# Altium schematic sheet MR26_GSS_3.SchDoc
size 388 x 296 mm; Origin: Eagle; OriginPath: C:\Users\David Nguyen\Downloads\eagle\eagle\MR26_GSS.sch; OriginSheet: 4; OriginDescription: 05 FPGA power & decoupling
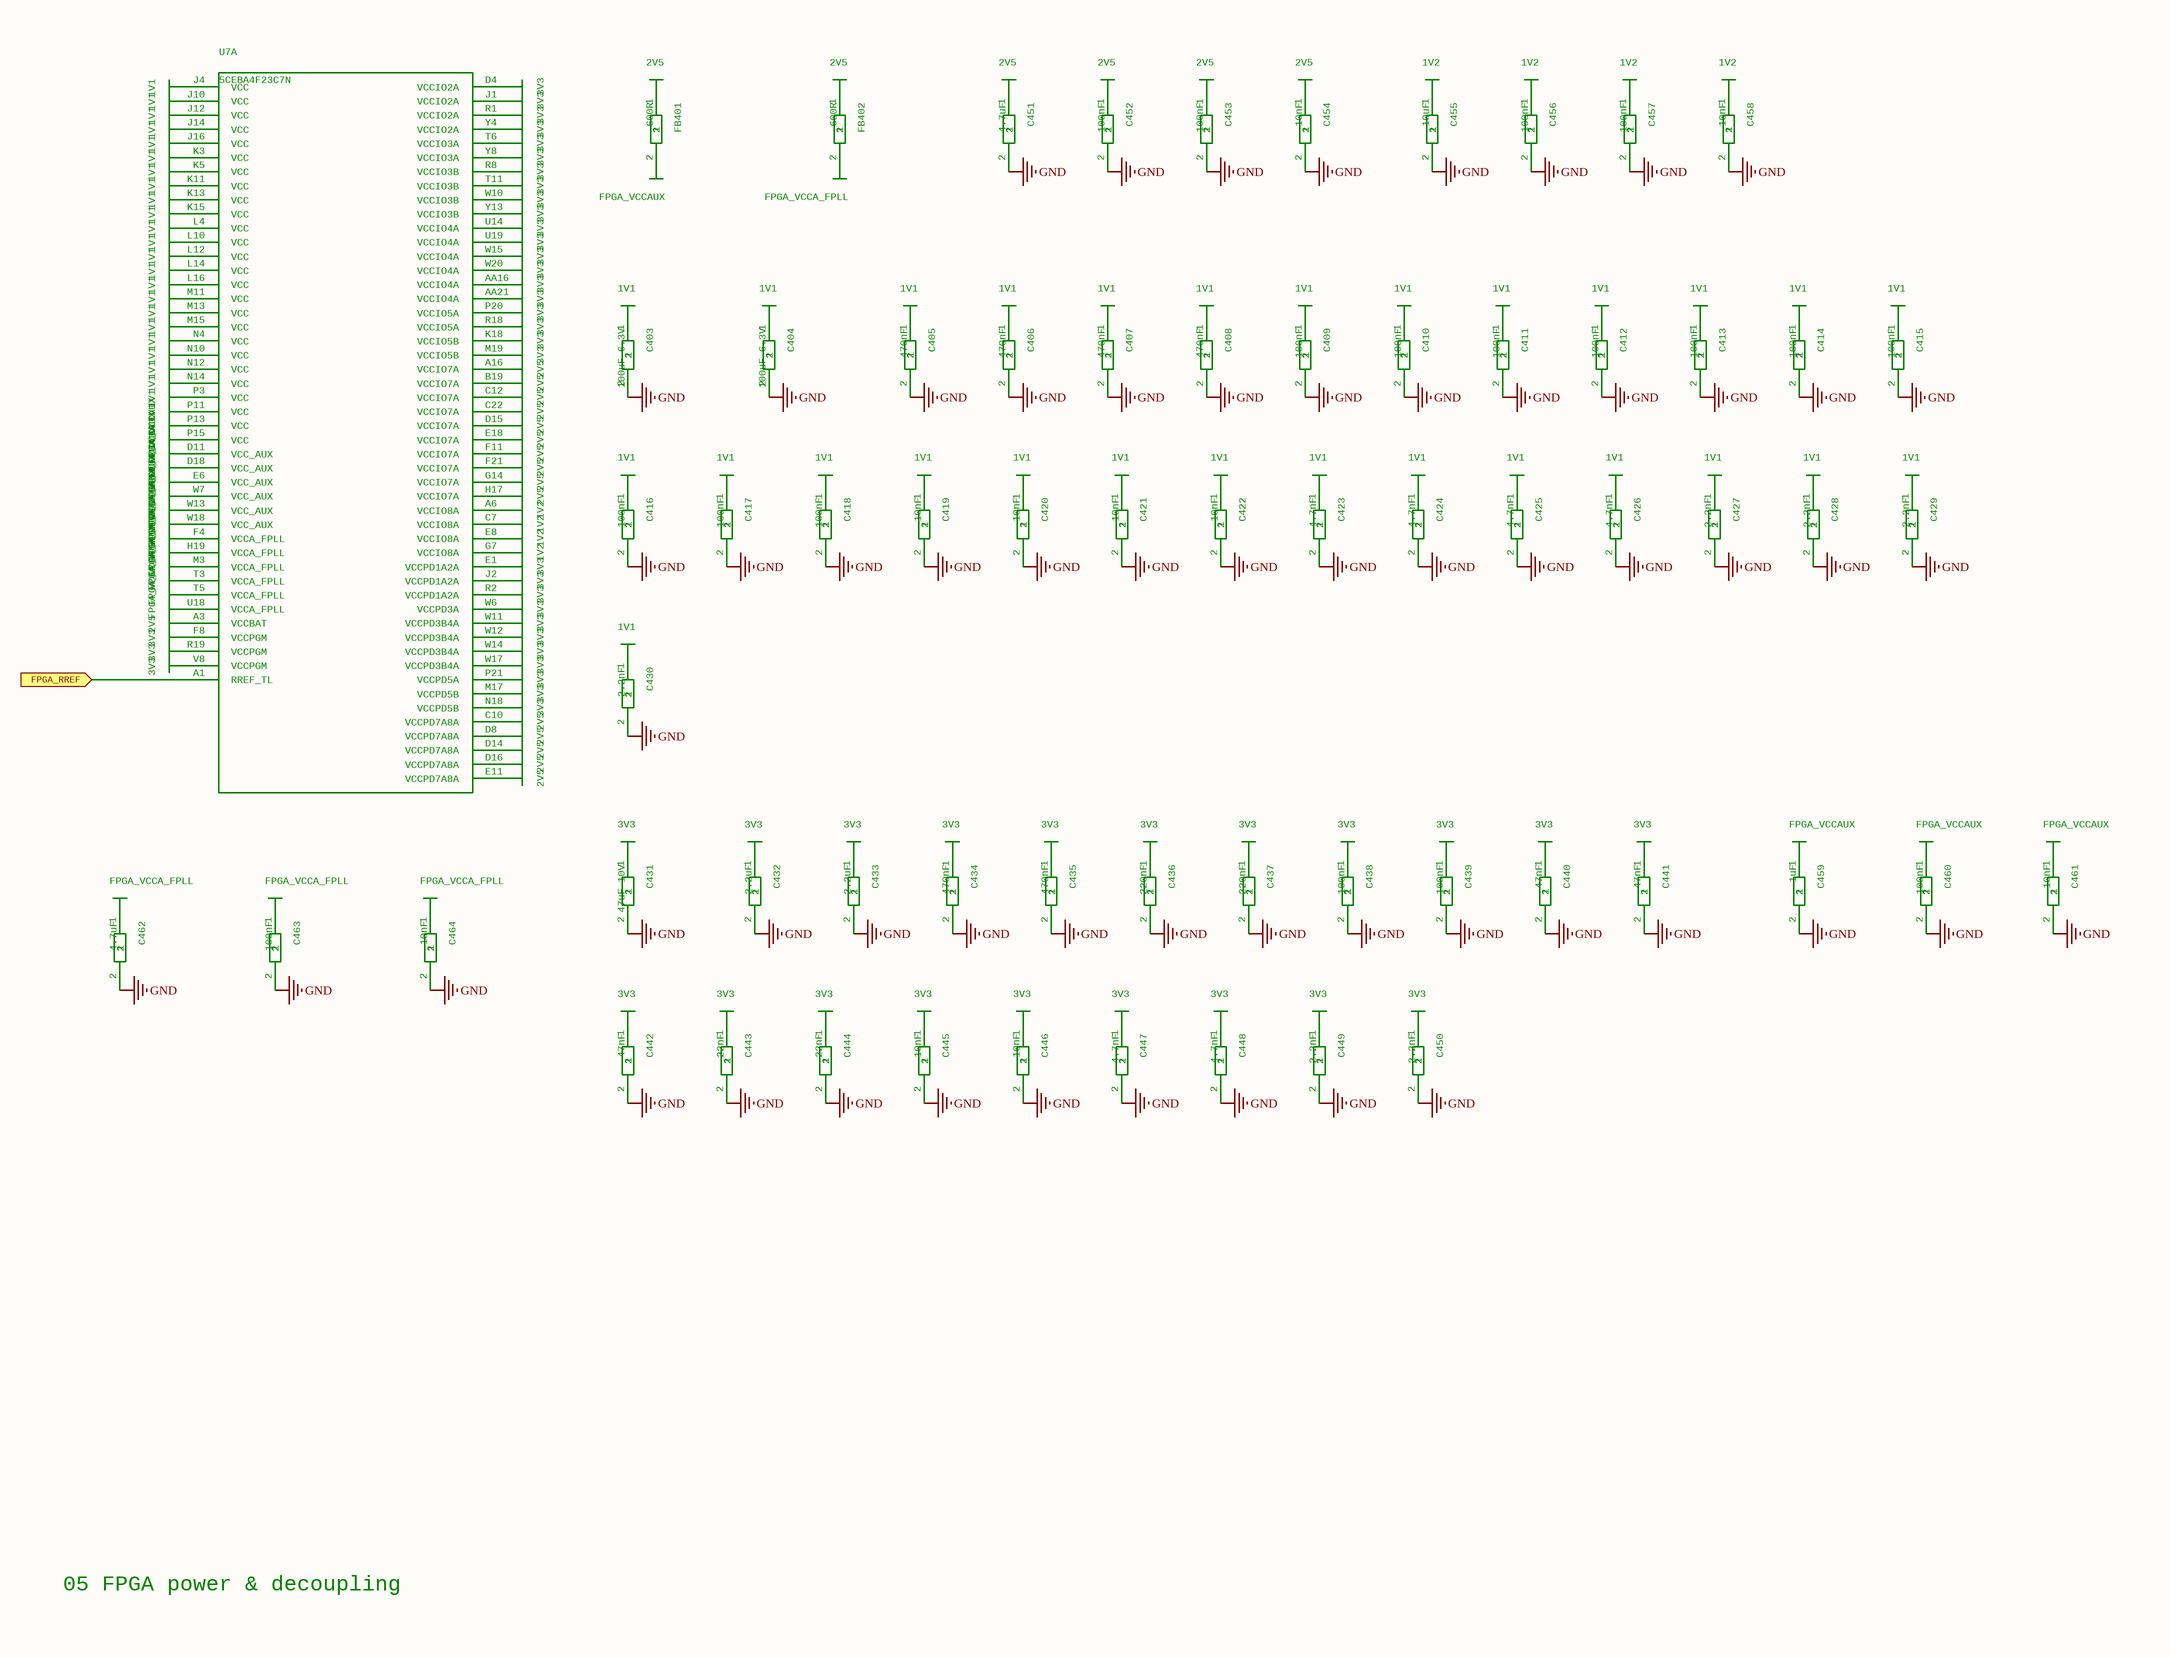
[diagram p0: MR26_GSS_3.SchDoc]

## Parts
C403  100uF 6.3V  [C_1210]
C404  100uF 6.3V  [C_1210]
C405  470nF  [C_0402]
C406  470nF  [C_0402]
C407  470nF  [C_0402]
C408  470nF  [C_0402]
C409  100nF  [C_0402]
C410  100nF  [C_0402]
C411  100nF  [C_0402]
C412  100nF  [C_0402]
C413  100nF  [C_0402]
C414  100nF  [C_0402]
C415  100nF  [C_0402]
C416  100nF  [C_0402]
C417  100nF  [C_0402]
C418  100nF  [C_0402]
C419  10nF  [C_0402]
C420  10nF  [C_0402]
C421  10nF  [C_0402]
C422  10nF  [C_0402]
C423  4.7nF  [C_0402]
C424  4.7nF  [C_0402]
C425  4.7nF  [C_0402]
C426  4.7nF  [C_0402]
C427  2.2nF  [C_0402]
C428  2.2nF  [C_0402]
C429  2.2nF  [C_0402]
C430  2.2nF  [C_0402]
C431  47uF 10V  [C_1210]
C432  2.2uF  [C_0603]
C433  2.2uF  [C_0603]
C434  470nF  [C_0402]
C435  470nF  [C_0402]
C436  220nF  [C_0402]
C437  220nF  [C_0402]
C438  100nF  [C_0402]
C439  100nF  [C_0402]
C440  47nF  [C_0402]
C441  47nF  [C_0402]
C442  47nF  [C_0402]
C443  22nF  [C_0402]
C444  22nF  [C_0402]
C445  10nF  [C_0402]
C446  10nF  [C_0402]
C447  4.7nF  [C_0402]
C448  4.7nF  [C_0402]
C449  2.2nF  [C_0402]
C450  2.2nF  [C_0402]
C451  4.7uF  [C_0603]
C452  100nF  [C_0402]
C453  100nF  [C_0402]
C454  10nF  [C_0402]
C455  10uF  [C_0603]
C456  100nF  [C_0402]
C457  100nF  [C_0402]
C458  10nF  [C_0402]
C459  1uF  [C_0402]
C460  100nF  [C_0402]
C461  10nF  [C_0402]
C462  4.7uF  [C_0603]
C463  100nF  [C_0402]
C464  10nF  [C_0402]
FB401  600R  [L_0603]
FB402  600R  [L_0603]
PWR0189  1V1
PWR0190  1V1
PWR0191  1V1
PWR0192  1V1
PWR0193  1V1
PWR0194  1V1
PWR0195  1V1
PWR0196  1V1
PWR0197  1V1
PWR0198  1V1
PWR0199  1V1
PWR0200  1V1
PWR0201  1V1
PWR0202  1V1
PWR0203  1V1
PWR0204  1V1
PWR0205  1V1
PWR0206  1V1
PWR0207  1V1
PWR0208  1V1
PWR0209  1V1
PWR0210  1V1
PWR0211  1V1
PWR0212  1V1
PWR0213  1V1
PWR0214  1V1
PWR0215  FPGA_VCCAUX
PWR0216  FPGA_VCCAUX
PWR0217  FPGA_VCCAUX
PWR0218  FPGA_VCCAUX
PWR0219  FPGA_VCCAUX
PWR0220  FPGA_VCCAUX
PWR0221  FPGA_VCCA_FPLL
PWR0222  FPGA_VCCA_FPLL
PWR0223  FPGA_VCCA_FPLL
PWR0224  FPGA_VCCA_FPLL
PWR0225  FPGA_VCCA_FPLL
PWR0226  FPGA_VCCA_FPLL
PWR0227  2V5
PWR0228  3V3
PWR0229  3V3
PWR0230  3V3
PWR0231  3V3
PWR0232  3V3
PWR0233  3V3
PWR0234  3V3
PWR0235  3V3
PWR0236  3V3
PWR0237  3V3
PWR0238  3V3
PWR0239  3V3
PWR0240  3V3
PWR0241  3V3
PWR0242  3V3
PWR0243  3V3
PWR0244  3V3
PWR0245  3V3
PWR0246  3V3
PWR0247  3V3
PWR0248  3V3
PWR0249  3V3
PWR0250  3V3
PWR0251  2V5
PWR0252  2V5
PWR0253  2V5
PWR0254  2V5
PWR0255  2V5
PWR0256  2V5
PWR0257  2V5
PWR0258  2V5
PWR0259  2V5
PWR0260  2V5
PWR0261  1V2
PWR0262  1V2
PWR0263  1V2
PWR0264  1V2
PWR0265  3V3
PWR0266  3V3
PWR0267  3V3
PWR0268  3V3
PWR0269  3V3
PWR0270  3V3
PWR0271  3V3
PWR0272  3V3
PWR0273  3V3
PWR0274  3V3
PWR0275  3V3
PWR0276  2V5
PWR0277  2V5
PWR0278  2V5
PWR0279  2V5
PWR0280  2V5
PWR0281  2V5
PWR0282  FPGA_VCCAUX
PWR0283  2V5
PWR0284  FPGA_VCCA_FPLL
PWR0285  1V1
PWR0287  1V1
PWR0289  1V1
PWR0291  1V1
PWR0293  1V1
PWR0295  1V1
PWR0297  1V1
PWR0299  1V1
PWR0301  1V1
PWR0303  1V1
PWR0305  1V1
PWR0307  1V1
PWR0309  1V1
PWR0311  1V1
PWR0313  1V1
PWR0315  1V1
PWR0317  1V1
PWR0319  1V1
PWR0321  1V1
PWR0323  1V1
PWR0325  1V1
PWR0327  1V1
PWR0329  1V1
PWR0331  1V1
PWR0333  1V1
PWR0335  1V1
PWR0337  1V1
PWR0339  1V1
PWR0341  3V3
PWR0343  3V3
PWR0345  3V3
PWR0347  3V3
PWR0349  3V3
PWR0351  3V3
PWR0353  3V3
PWR0355  3V3
PWR0357  3V3
PWR0359  3V3
PWR0361  3V3
PWR0363  3V3
PWR0365  3V3
PWR0367  3V3
PWR0369  3V3
PWR0371  3V3
PWR0373  3V3
PWR0375  3V3
PWR0377  3V3
PWR0379  3V3
PWR0381  2V5
PWR0383  2V5
PWR0385  2V5
PWR0387  2V5
PWR0389  1V2
PWR0391  1V2
PWR0393  1V2
PWR0395  1V2
PWR0397  FPGA_VCCAUX
PWR0399  FPGA_VCCAUX
PWR0401  FPGA_VCCAUX
PWR0403  FPGA_VCCA_FPLL
PWR0405  FPGA_VCCA_FPLL
PWR0407  FPGA_VCCA_FPLL
U7  5CEBA4F23C7N  [FBGA-484_23x23_1.0mm]  (part A of 12)

## Ports
FPGA_RREF (in)

## Nets
GND: C403.2 C404.2 C405.2 C406.2 C407.2 C408.2 C409.2 C410.2 C411.2 C412.2 C413.2 C414.2 C415.2 C416.2 C417.2 C418.2 C419.2 C420.2 C421.2 C422.2 C423.2 C424.2 C425.2 C426.2 C427.2 C428.2 C429.2 C430.2 C431.2 C432.2 C433.2 C434.2 C435.2 C436.2 C437.2 C438.2 C439.2 C440.2 C441.2 C442.2 C443.2 C444.2 C445.2 C446.2 C447.2 C448.2 C449.2 C450.2 C451.2 C452.2 C453.2 C454.2 C455.2 C456.2 C457.2 C458.2 C459.2 C460.2 C461.2 C462.2 C463.2 C464.2
FPGA_RREF: U7.A1(RREF_TL) ; port FPGA_RREF
NetC403_1: C403.1 PWR0285.?1(1V1)
NetC404_1: C404.1 PWR0287.?1(1V1)
NetC405_1: C405.1 PWR0289.?1(1V1)
NetC406_1: C406.1 PWR0291.?1(1V1)
NetC407_1: C407.1 PWR0293.?1(1V1)
NetC408_1: C408.1 PWR0295.?1(1V1)
NetC409_1: C409.1 PWR0297.?1(1V1)
NetC410_1: C410.1 PWR0299.?1(1V1)
NetC411_1: C411.1 PWR0301.?1(1V1)
NetC412_1: C412.1 PWR0303.?1(1V1)
NetC413_1: C413.1 PWR0305.?1(1V1)
NetC414_1: C414.1 PWR0307.?1(1V1)
NetC415_1: C415.1 PWR0309.?1(1V1)
NetC416_1: C416.1 PWR0311.?1(1V1)
NetC417_1: C417.1 PWR0313.?1(1V1)
NetC418_1: C418.1 PWR0315.?1(1V1)
NetC419_1: C419.1 PWR0317.?1(1V1)
NetC420_1: C420.1 PWR0319.?1(1V1)
NetC421_1: C421.1 PWR0321.?1(1V1)
NetC422_1: C422.1 PWR0323.?1(1V1)
NetC423_1: C423.1 PWR0325.?1(1V1)
NetC424_1: C424.1 PWR0327.?1(1V1)
NetC425_1: C425.1 PWR0329.?1(1V1)
NetC426_1: C426.1 PWR0331.?1(1V1)
NetC427_1: C427.1 PWR0333.?1(1V1)
NetC428_1: C428.1 PWR0335.?1(1V1)
NetC429_1: C429.1 PWR0337.?1(1V1)
NetC430_1: C430.1 PWR0339.?1(1V1)
NetC431_1: C431.1 PWR0341.?1(3V3)
NetC432_1: C432.1 PWR0343.?1(3V3)
NetC433_1: C433.1 PWR0345.?1(3V3)
NetC434_1: C434.1 PWR0347.?1(3V3)
NetC435_1: C435.1 PWR0349.?1(3V3)
NetC436_1: C436.1 PWR0351.?1(3V3)
NetC437_1: C437.1 PWR0353.?1(3V3)
NetC438_1: C438.1 PWR0355.?1(3V3)
NetC439_1: C439.1 PWR0357.?1(3V3)
NetC440_1: C440.1 PWR0359.?1(3V3)
NetC441_1: C441.1 PWR0361.?1(3V3)
NetC442_1: C442.1 PWR0363.?1(3V3)
NetC443_1: C443.1 PWR0365.?1(3V3)
NetC444_1: C444.1 PWR0367.?1(3V3)
NetC445_1: C445.1 PWR0369.?1(3V3)
NetC446_1: C446.1 PWR0371.?1(3V3)
NetC447_1: C447.1 PWR0373.?1(3V3)
NetC448_1: C448.1 PWR0375.?1(3V3)
NetC449_1: C449.1 PWR0377.?1(3V3)
NetC450_1: C450.1 PWR0379.?1(3V3)
NetC451_1: C451.1 PWR0381.?1(2V5)
NetC452_1: C452.1 PWR0383.?1(2V5)
NetC453_1: C453.1 PWR0385.?1(2V5)
NetC454_1: C454.1 PWR0387.?1(2V5)
NetC455_1: C455.1 PWR0389.?1(1V2)
NetC456_1: C456.1 PWR0391.?1(1V2)
NetC457_1: C457.1 PWR0393.?1(1V2)
NetC458_1: C458.1 PWR0395.?1(1V2)
NetC459_1: C459.1 PWR0397.?1(FPGA_VCCAUX)
NetC460_1: C460.1 PWR0399.?1(FPGA_VCCAUX)
NetC461_1: C461.1 PWR0401.?1(FPGA_VCCAUX)
NetC462_1: C462.1 PWR0403.?1(FPGA_VCCA_FPLL)
NetC463_1: C463.1 PWR0405.?1(FPGA_VCCA_FPLL)
NetC464_1: C464.1 PWR0407.?1(FPGA_VCCA_FPLL)
NetFB401_1: FB401.1 PWR0281.?1(2V5)
NetFB401_2: FB401.2 PWR0282.?1(FPGA_VCCAUX)
NetFB402_1: FB402.1 PWR0283.?1(2V5)
NetFB402_2: FB402.2 PWR0284.?1(FPGA_VCCA_FPLL)
NetPWR0189_?1: PWR0189.?1(1V1) U7.J4(VCC)
NetPWR0190_?1: PWR0190.?1(1V1) U7.J10(VCC)
NetPWR0191_?1: PWR0191.?1(1V1) U7.J12(VCC)
NetPWR0192_?1: PWR0192.?1(1V1) U7.J14(VCC)
NetPWR0193_?1: PWR0193.?1(1V1) U7.J16(VCC)
NetPWR0194_?1: PWR0194.?1(1V1) U7.K3(VCC)
NetPWR0195_?1: PWR0195.?1(1V1) U7.K5(VCC)
NetPWR0196_?1: PWR0196.?1(1V1) U7.K11(VCC)
NetPWR0197_?1: PWR0197.?1(1V1) U7.K13(VCC)
NetPWR0198_?1: PWR0198.?1(1V1) U7.K15(VCC)
NetPWR0199_?1: PWR0199.?1(1V1) U7.L4(VCC)
NetPWR0200_?1: PWR0200.?1(1V1) U7.L10(VCC)
NetPWR0201_?1: PWR0201.?1(1V1) U7.L12(VCC)
NetPWR0202_?1: PWR0202.?1(1V1) U7.L14(VCC)
NetPWR0203_?1: PWR0203.?1(1V1) U7.L16(VCC)
NetPWR0204_?1: PWR0204.?1(1V1) U7.M11(VCC)
NetPWR0205_?1: PWR0205.?1(1V1) U7.M13(VCC)
NetPWR0206_?1: PWR0206.?1(1V1) U7.M15(VCC)
NetPWR0207_?1: PWR0207.?1(1V1) U7.N4(VCC)
NetPWR0208_?1: PWR0208.?1(1V1) U7.N10(VCC)
NetPWR0209_?1: PWR0209.?1(1V1) U7.N12(VCC)
NetPWR0210_?1: PWR0210.?1(1V1) U7.N14(VCC)
NetPWR0211_?1: PWR0211.?1(1V1) U7.P3(VCC)
NetPWR0212_?1: PWR0212.?1(1V1) U7.P11(VCC)
NetPWR0213_?1: PWR0213.?1(1V1) U7.P13(VCC)
NetPWR0214_?1: PWR0214.?1(1V1) U7.P15(VCC)
NetPWR0215_?1: PWR0215.?1(FPGA_VCCAUX) U7.D11(VCC_AUX)
NetPWR0216_?1: PWR0216.?1(FPGA_VCCAUX) U7.D18(VCC_AUX)
NetPWR0217_?1: PWR0217.?1(FPGA_VCCAUX) U7.E6(VCC_AUX)
NetPWR0218_?1: PWR0218.?1(FPGA_VCCAUX) U7.W7(VCC_AUX)
NetPWR0219_?1: PWR0219.?1(FPGA_VCCAUX) U7.W13(VCC_AUX)
NetPWR0220_?1: PWR0220.?1(FPGA_VCCAUX) U7.W18(VCC_AUX)
NetPWR0221_?1: PWR0221.?1(FPGA_VCCA_FPLL) U7.F4(VCCA_FPLL)
NetPWR0222_?1: PWR0222.?1(FPGA_VCCA_FPLL) U7.H19(VCCA_FPLL)
NetPWR0223_?1: PWR0223.?1(FPGA_VCCA_FPLL) U7.M3(VCCA_FPLL)
NetPWR0224_?1: PWR0224.?1(FPGA_VCCA_FPLL) U7.T3(VCCA_FPLL)
NetPWR0225_?1: PWR0225.?1(FPGA_VCCA_FPLL) U7.T5(VCCA_FPLL)
NetPWR0226_?1: PWR0226.?1(FPGA_VCCA_FPLL) U7.U18(VCCA_FPLL)
NetPWR0227_?1: PWR0227.?1(2V5) U7.A3(VCCBAT)
NetPWR0228_?1: PWR0228.?1(3V3) U7.F8(VCCPGM)
NetPWR0229_?1: PWR0229.?1(3V3) U7.R19(VCCPGM)
NetPWR0230_?1: PWR0230.?1(3V3) U7.V8(VCCPGM)
NetPWR0231_?1: PWR0231.?1(3V3) U7.D4(VCCIO2A)
NetPWR0232_?1: PWR0232.?1(3V3) U7.J1(VCCIO2A)
NetPWR0233_?1: PWR0233.?1(3V3) U7.R1(VCCIO2A)
NetPWR0234_?1: PWR0234.?1(3V3) U7.Y4(VCCIO2A)
NetPWR0235_?1: PWR0235.?1(3V3) U7.T6(VCCIO3A)
NetPWR0236_?1: PWR0236.?1(3V3) U7.Y8(VCCIO3A)
NetPWR0237_?1: PWR0237.?1(3V3) U7.R8(VCCIO3B)
NetPWR0238_?1: PWR0238.?1(3V3) U7.T11(VCCIO3B)
NetPWR0239_?1: PWR0239.?1(3V3) U7.W10(VCCIO3B)
NetPWR0240_?1: PWR0240.?1(3V3) U7.Y13(VCCIO3B)
NetPWR0241_?1: PWR0241.?1(3V3) U7.U14(VCCIO4A)
NetPWR0242_?1: PWR0242.?1(3V3) U7.U19(VCCIO4A)
NetPWR0243_?1: PWR0243.?1(3V3) U7.W15(VCCIO4A)
NetPWR0244_?1: PWR0244.?1(3V3) U7.W20(VCCIO4A)
NetPWR0245_?1: PWR0245.?1(3V3) U7.AA16(VCCIO4A)
NetPWR0246_?1: PWR0246.?1(3V3) U7.AA21(VCCIO4A)
NetPWR0247_?1: PWR0247.?1(3V3) U7.P20(VCCIO5A)
NetPWR0248_?1: PWR0248.?1(3V3) U7.R18(VCCIO5A)
NetPWR0249_?1: PWR0249.?1(3V3) U7.K18(VCCIO5B)
NetPWR0250_?1: PWR0250.?1(3V3) U7.M19(VCCIO5B)
NetPWR0251_?1: PWR0251.?1(2V5) U7.A16(VCCIO7A)
NetPWR0252_?1: PWR0252.?1(2V5) U7.B19(VCCIO7A)
NetPWR0253_?1: PWR0253.?1(2V5) U7.C12(VCCIO7A)
NetPWR0254_?1: PWR0254.?1(2V5) U7.C22(VCCIO7A)
NetPWR0255_?1: PWR0255.?1(2V5) U7.D15(VCCIO7A)
NetPWR0256_?1: PWR0256.?1(2V5) U7.E18(VCCIO7A)
NetPWR0257_?1: PWR0257.?1(2V5) U7.F11(VCCIO7A)
NetPWR0258_?1: PWR0258.?1(2V5) U7.F21(VCCIO7A)
NetPWR0259_?1: PWR0259.?1(2V5) U7.G14(VCCIO7A)
NetPWR0260_?1: PWR0260.?1(2V5) U7.H17(VCCIO7A)
NetPWR0261_?1: PWR0261.?1(1V2) U7.A6(VCCIO8A)
NetPWR0262_?1: PWR0262.?1(1V2) U7.C7(VCCIO8A)
NetPWR0263_?1: PWR0263.?1(1V2) U7.E8(VCCIO8A)
NetPWR0264_?1: PWR0264.?1(1V2) U7.G7(VCCIO8A)
NetPWR0265_?1: PWR0265.?1(3V3) U7.E1(VCCPD1A2A)
NetPWR0266_?1: PWR0266.?1(3V3) U7.J2(VCCPD1A2A)
NetPWR0267_?1: PWR0267.?1(3V3) U7.R2(VCCPD1A2A)
NetPWR0268_?1: PWR0268.?1(3V3) U7.W6(VCCPD3A)
NetPWR0269_?1: PWR0269.?1(3V3) U7.W11(VCCPD3B4A)
NetPWR0270_?1: PWR0270.?1(3V3) U7.W12(VCCPD3B4A)
NetPWR0271_?1: PWR0271.?1(3V3) U7.W14(VCCPD3B4A)
NetPWR0272_?1: PWR0272.?1(3V3) U7.W17(VCCPD3B4A)
NetPWR0273_?1: PWR0273.?1(3V3) U7.P21(VCCPD5A)
NetPWR0274_?1: PWR0274.?1(3V3) U7.M17(VCCPD5B)
NetPWR0275_?1: PWR0275.?1(3V3) U7.N18(VCCPD5B)
NetPWR0276_?1: PWR0276.?1(2V5) U7.C10(VCCPD7A8A)
NetPWR0277_?1: PWR0277.?1(2V5) U7.D8(VCCPD7A8A)
NetPWR0278_?1: PWR0278.?1(2V5) U7.D14(VCCPD7A8A)
NetPWR0279_?1: PWR0279.?1(2V5) U7.D16(VCCPD7A8A)
NetPWR0280_?1: PWR0280.?1(2V5) U7.E11(VCCPD7A8A)

## Notes on the sheet
- 05 FPGA power & decoupling

## Library data of the parts
C403 C404 = CAPC_1210: MPN: CAP 100uF 6.3V 1210; GateName_1: G$1; SymbolName_1: CAP; DeviceName: C_1210; LibraryName: MR26; DeviceSetName: CAP
C405-C408 C434 C435 = CAPC_0402: MPN: CAP 470nF 0402; GateName_1: G$1; SymbolName_1: CAP; DeviceName: C_0402; LibraryName: MR26; DeviceSetName: CAP
C409-C418 C438 C439 C452 C453 C456 C457 C460 C463 = CAPC_0402: MPN: CAP 100nF 0402; GateName_1: G$1; SymbolName_1: CAP; DeviceName: C_0402; LibraryName: MR26; DeviceSetName: CAP
C419-C422 C445 C446 C454 C458 C461 C464 = CAPC_0402: MPN: CAP 10nF 0402; GateName_1: G$1; SymbolName_1: CAP; DeviceName: C_0402; LibraryName: MR26; DeviceSetName: CAP
C423-C426 C447 C448 = CAPC_0402: MPN: CAP 4.7nF 0402; GateName_1: G$1; SymbolName_1: CAP; DeviceName: C_0402; LibraryName: MR26; DeviceSetName: CAP
C427-C430 C449 C450 = CAPC_0402: MPN: CAP 2.2nF 0402; GateName_1: G$1; SymbolName_1: CAP; DeviceName: C_0402; LibraryName: MR26; DeviceSetName: CAP
C431 = CAPC_1210: MPN: CAP 47uF 10V 1210; GateName_1: G$1; SymbolName_1: CAP; DeviceName: C_1210; LibraryName: MR26; DeviceSetName: CAP
C432 C433 = CAPC_0603: MPN: CAP 2.2uF 0603; GateName_1: G$1; SymbolName_1: CAP; DeviceName: C_0603; LibraryName: MR26; DeviceSetName: CAP
C436 C437 = CAPC_0402: MPN: CAP 220nF 0402; GateName_1: G$1; SymbolName_1: CAP; DeviceName: C_0402; LibraryName: MR26; DeviceSetName: CAP
C440-C442 = CAPC_0402: MPN: CAP 47nF 0402; GateName_1: G$1; SymbolName_1: CAP; DeviceName: C_0402; LibraryName: MR26; DeviceSetName: CAP
C443 C444 = CAPC_0402: MPN: CAP 22nF 0402; GateName_1: G$1; SymbolName_1: CAP; DeviceName: C_0402; LibraryName: MR26; DeviceSetName: CAP
C451 C462 = CAPC_0603: MPN: CAP 4.7uF 0603; GateName_1: G$1; SymbolName_1: CAP; DeviceName: C_0603; LibraryName: MR26; DeviceSetName: CAP
C455 = CAPC_0603: MPN: CAP 10uF 0603; GateName_1: G$1; SymbolName_1: CAP; DeviceName: C_0603; LibraryName: MR26; DeviceSetName: CAP
C459 = CAPC_0402: MPN: CAP 1uF 0402; GateName_1: G$1; SymbolName_1: CAP; DeviceName: C_0402; LibraryName: MR26; DeviceSetName: CAP
FB401 FB402 = FERRITEL_0603: MPN: Murata BLM18KG601SN1D; GateName_1: G$1; SymbolName_1: FERRITE; DeviceName: L_0603; LibraryName: MR26; DeviceSetName: FERRITE
PWR0189 PWR0190 PWR0191 PWR0192 PWR0193 PWR0194 PWR0195 PWR0196 PWR0197 PWR0198 PWR0199 PWR0200 PWR0201 PWR0202 PWR0203 PWR0204 PWR0205 PWR0206 PWR0207 PWR0208 PWR0209 PWR0210 PWR0211 PWR0212 PWR0213 PWR0214 PWR0285 PWR0287 PWR0289 PWR0291 PWR0293 PWR0295 PWR0297 PWR0299 PWR0301 PWR0303 PWR0305 PWR0307 PWR0309 PWR0311 PWR0313 PWR0315 PWR0317 PWR0319 PWR0321 PWR0323 PWR0325 PWR0327 PWR0329 PWR0331 PWR0333 PWR0335 PWR0337 PWR0339 = PWR_1V1: GateName_1: G$1; SymbolName_1: PWR_1V1; LibraryName: MR26; DeviceSetName: PWR_1V1
PWR0215 PWR0216 PWR0217 PWR0218 PWR0219 PWR0220 PWR0282 PWR0397 PWR0399 PWR0401 = PWR_FPGA_VCCAUX: GateName_1: G$1; SymbolName_1: PWR_FPGA_VCCAUX; LibraryName: MR26; DeviceSetName: PWR_FPGA_VCCAUX
PWR0221 PWR0222 PWR0223 PWR0224 PWR0225 PWR0226 PWR0284 PWR0403 PWR0405 PWR0407 = PWR_FPGA_VCCA_FPLL: GateName_1: G$1; SymbolName_1: PWR_FPGA_VCCA_FPLL; LibraryName: MR26; DeviceSetName: PWR_FPGA_VCCA_FPLL
PWR0227 PWR0251 PWR0252 PWR0253 PWR0254 PWR0255 PWR0256 PWR0257 PWR0258 PWR0259 PWR0260 PWR0276 PWR0277 PWR0278 PWR0279 PWR0280 PWR0281 PWR0283 PWR0381 PWR0383 PWR0385 PWR0387 = PWR_2V5: GateName_1: G$1; SymbolName_1: PWR_2V5; LibraryName: MR26; DeviceSetName: PWR_2V5
PWR0228 PWR0229 PWR0230 PWR0231 PWR0232 PWR0233 PWR0234 PWR0235 PWR0236 PWR0237 PWR0238 PWR0239 PWR0240 PWR0241 PWR0242 PWR0243 PWR0244 PWR0245 PWR0246 PWR0247 PWR0248 PWR0249 PWR0250 PWR0265 PWR0266 PWR0267 PWR0268 PWR0269 PWR0270 PWR0271 PWR0272 PWR0273 PWR0274 PWR0275 PWR0341 PWR0343 PWR0345 PWR0347 PWR0349 PWR0351 PWR0353 PWR0355 PWR0357 PWR0359 PWR0361 PWR0363 PWR0365 PWR0367 PWR0369 PWR0371 PWR0373 PWR0375 PWR0377 PWR0379 = PWR_3V3: GateName_1: G$1; SymbolName_1: PWR_3V3; LibraryName: MR26; DeviceSetName: PWR_3V3
PWR0261 PWR0262 PWR0263 PWR0264 PWR0389 PWR0391 PWR0393 PWR0395 = PWR_1V2: GateName_1: G$1; SymbolName_1: PWR_1V2; LibraryName: MR26; DeviceSetName: PWR_1V2
U7 = 5CEBA4F23C7NFBGA-484_23x23_1.0mm: GateName_1: A; SymbolName_1: 5CEBA4F23C7N_A; GateName_2: B; SymbolName_2: 5CEBA4F23C7N_B; GateName_3: C; SymbolName_3: 5CEBA4F23C7N_C; GateName_4: D; SymbolName_4: 5CEBA4F23C7N_D; GateName_5: E; SymbolName_5: 5CEBA4F23C7N_E; GateName_6: F; SymbolName_6: 5CEBA4F23C7N_F; GateName_7: G; SymbolName_7: 5CEBA4F23C7N_G; GateName_8: H; SymbolName_8: 5CEBA4F23C7N_H; GateName_9: I; SymbolName_9: 5CEBA4F23C7N_I; GateName_10: J; SymbolName_10: 5CEBA4F23C7N_J; GateName_11: K; SymbolName_11: 5CEBA4F23C7N_K; GateName_12: L; SymbolName_12: 5CEBA4F23C7N_L; DeviceName: FBGA-484_23x23_1.0mm; LibraryName: MR26; DeviceSetName: 5CEBA4F23C7N; MPN: 5CEBA4F23C7N